# Altium schematic sheet RSD_M1_MOTORCYCLE_UNIT_V2.SchDoc
size A3
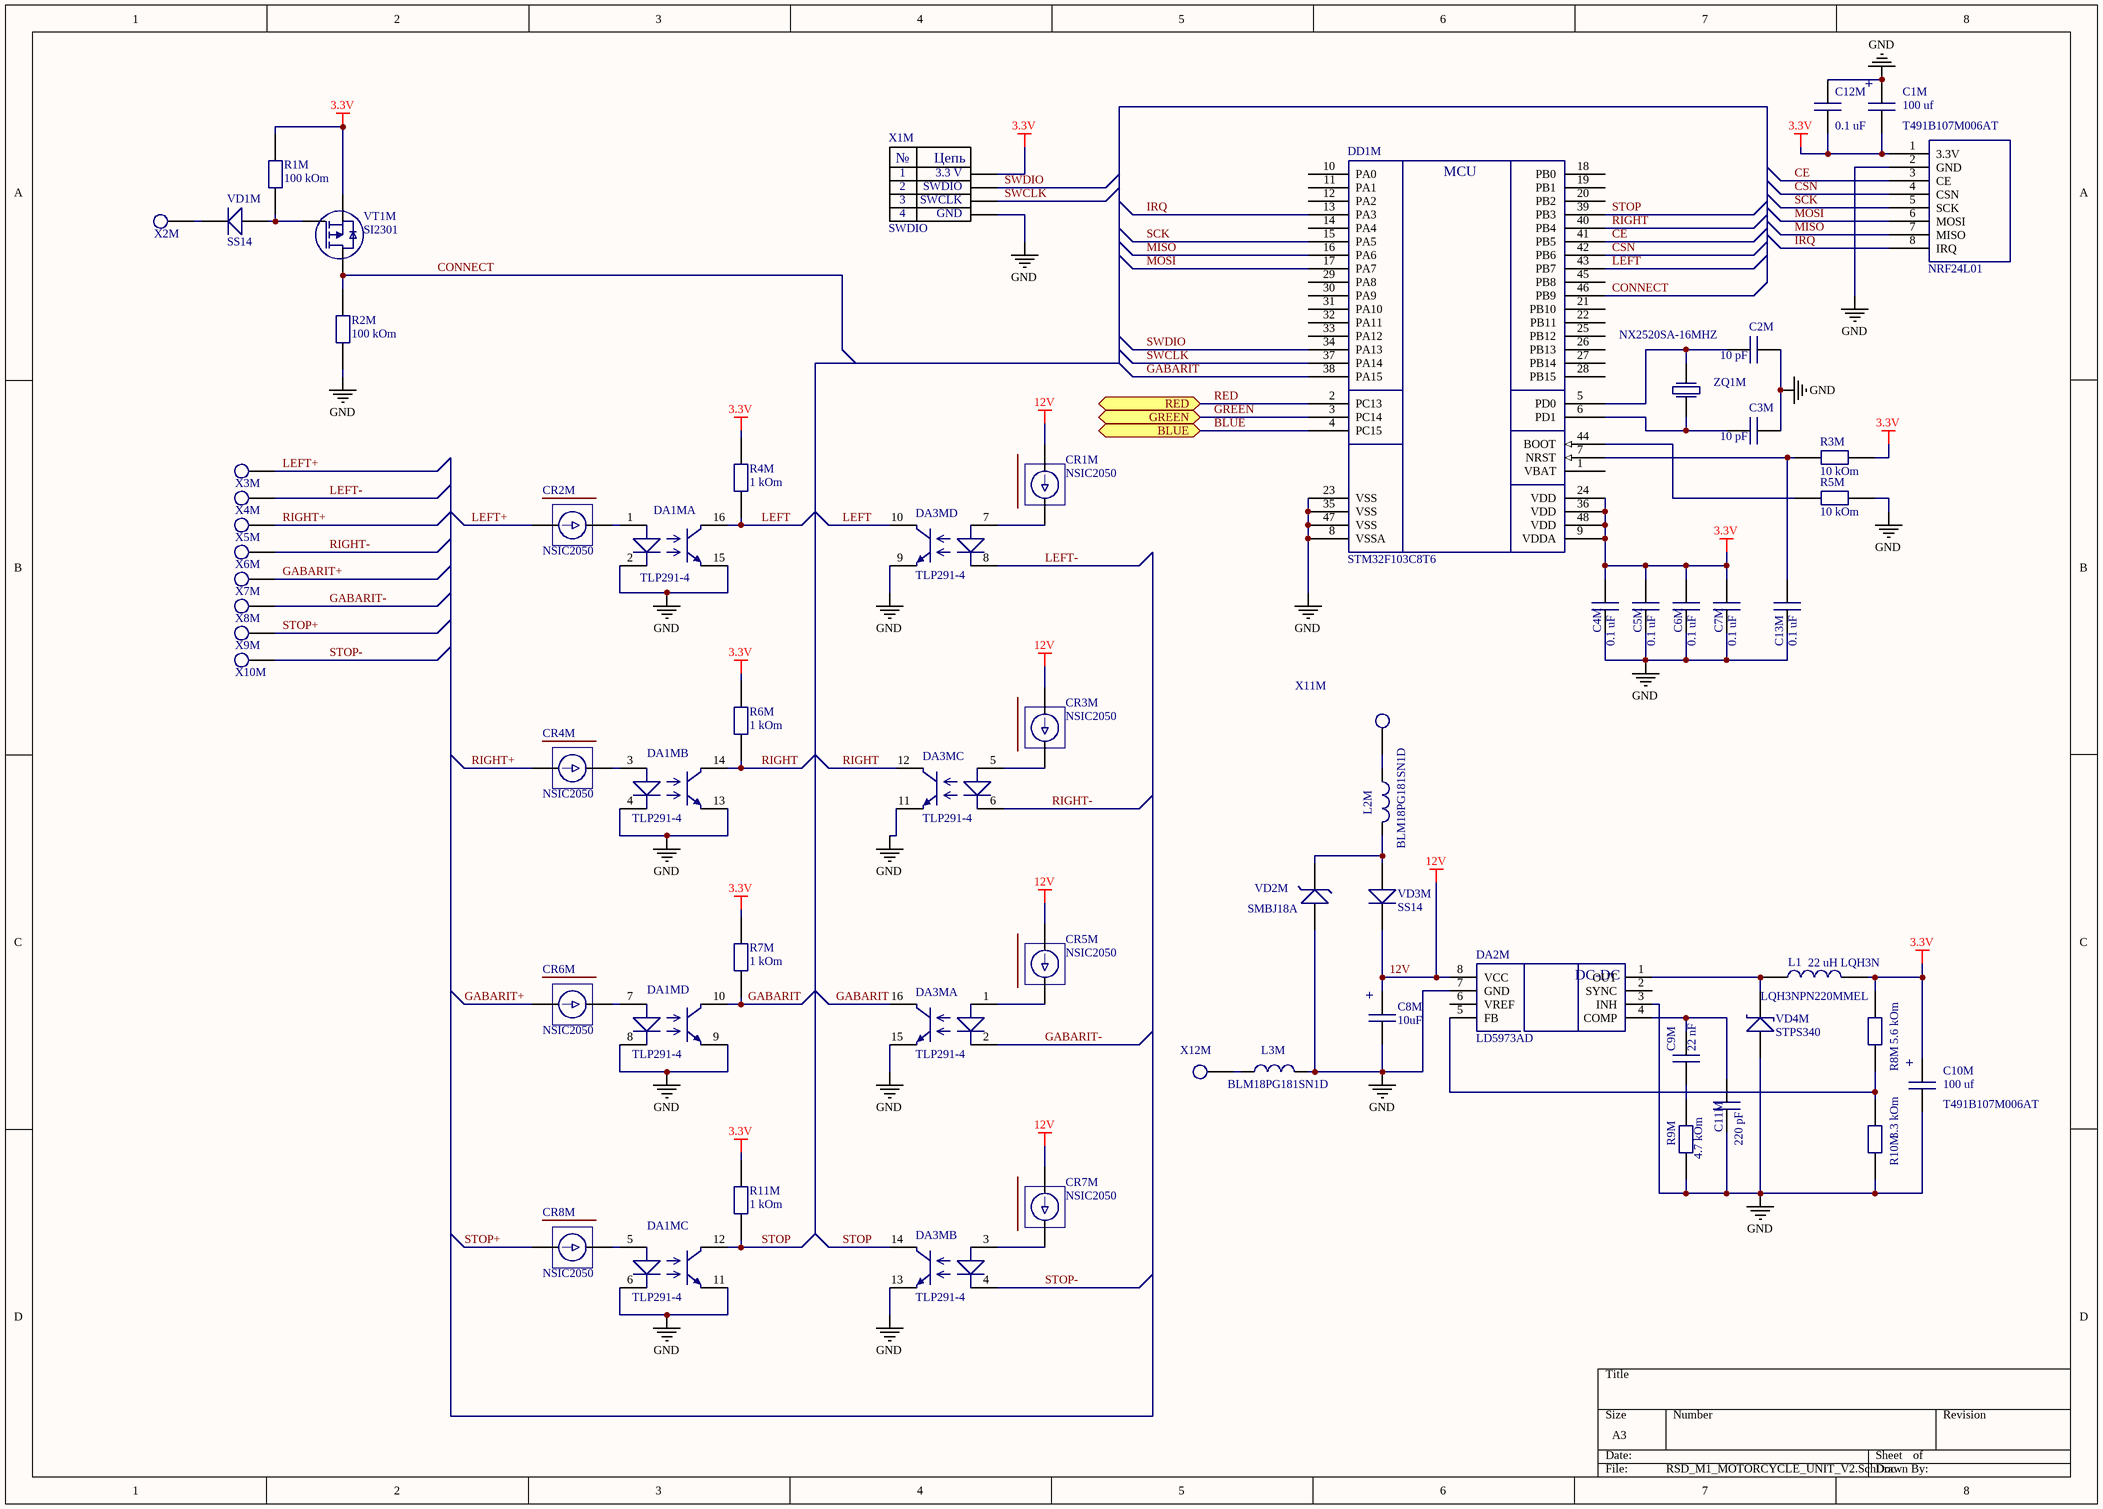
[diagram p0: RSD_M1_MOTORCYCLE_UNIT_V2.SchDoc]

## Parts
C1M  100 uf  value T491B107M006AT  [tantal_case_B]
C2M  value 10 pF  [CAP0603]  (hidden comment: Capacitor)
C3M  value 10 pF  [CAP0603]  (hidden comment: Capacitor)
C4M  value 0.1 uF  [CAP0603]  (hidden comment: Capacitor)
C5M  value 0.1 uF  [CAP0603]  (hidden comment: Capacitor)
C6M  value 0.1 uF  [CAP0603]  (hidden comment: Capacitor)
C7M  value 0.1 uF  [CAP0603]  (hidden comment: Capacitor)
C8M  value 10uF  [tantal_case_A]  (hidden comment: Capacitor_Polar)
C9M  value 22 nF  [CAP0603]  (hidden comment: Capacitor)
C10M  100 uf  value T491B107M006AT  [tantal_case_B]
C11M  value 220 pF  [CAP0603]  (hidden comment: Capacitor)
C12M  value 0.1 uF  [CAP0603]  (hidden comment: Capacitor)
C13M  value 0.1 uF  [CAP0603]  (hidden comment: Capacitor)
CR1M  value NSIC2050  [SMB1]  (hidden comment: NSIC20XX)
CR2M  value NSIC2050  [SMB1]  (hidden comment: NSIC20XX)
CR3M  value NSIC2050  [SMB1]  (hidden comment: NSIC20XX)
CR4M  value NSIC2050  [SMB1]  (hidden comment: NSIC20XX)
CR5M  value NSIC2050  [SMB1]  (hidden comment: NSIC20XX)
CR6M  value NSIC2050  [SMB1]  (hidden comment: NSIC20XX)
CR7M  value NSIC2050  [SMB1]  (hidden comment: NSIC20XX)
CR8M  value NSIC2050  [SMB1]  (hidden comment: NSIC20XX)
DA1M  TLP291-4  [SOP16]  (parts A,B,C,D of 4)
DA2M  LD5973AD  [SOIC-8]
DA3M  TLP291-4  [SOP16]  (parts A,B,C,D of 4)
DD1M  value STM32F103C8T6  [STM32F103C8T6]  (hidden comment: STM32F103C8Tx)
L1  value 22 uH LQH3N  PN: LQH3NPN220MMEL  [LQH3N]  (hidden comment: coil)
L2M  value BLM18PG181SN1D  [IND0603]  (hidden comment: coil)
L3M  value BLM18PG181SN1D  [IND0603]  (hidden comment: coil)
NRF1M  NRF24L01  [NRF24L01]
R1M  value 100 kOm  [Res0603]  (hidden comment: Resistor)
R2M  value 100 kOm  [Res0603]  (hidden comment: Resistor)
R3M  value 10 kOm  [Res0603]  (hidden comment: Resistor)
R4M  value 1 kOm  [Res0603]  (hidden comment: Resistor)
R5M  value 10 kOm  [Res0603]  (hidden comment: Resistor)
R6M  value 1 kOm  [Res0603]  (hidden comment: Resistor)
R7M  value 1 kOm  [Res0603]  (hidden comment: Resistor)
R8M  value 5.6 kOm  [Res0603]  (hidden comment: Resistor)
R9M  value 4.7 kOm  [Res0603]  (hidden comment: Resistor)
R10M  value 3.3 kOm  [Res0603]  (hidden comment: Resistor)
R11M  value 1 kOm  [Res0603]  (hidden comment: Resistor)
VD1M  value SS14  [SMA-F]  (hidden comment: Diode)
VD2M  value SMBJ18A  [SMB1]  (hidden comment: Suppressor)
VD3M  value SS14  [SMA-F]  (hidden comment: Diode)
VD4M  value STPS340  [SMB1]  (hidden comment: Schottky)
VT1M  value SI2301  [SOT 23]  (hidden comment: MOSFET-P)
X1M  SWDIO  1: 3.3 V  3: SWCLK  4: GND  [SWDIO]
X2M  WIRE_CONNECT  [WIRE_CONNECT]  (value not drawn)
X3M  WIRE_CONNECT  [WIRE_CONNECT]  (value not drawn)
X4M  WIRE_CONNECT  [WIRE_CONNECT]  (value not drawn)
X5M  WIRE_CONNECT  [WIRE_CONNECT]  (value not drawn)
X6M  WIRE_CONNECT  [WIRE_CONNECT]  (value not drawn)
X7M  WIRE_CONNECT  [WIRE_CONNECT]  (value not drawn)
X8M  WIRE_CONNECT  [WIRE_CONNECT]  (value not drawn)
X9M  WIRE_CONNECT  [WIRE_CONNECT]  (value not drawn)
X10M  WIRE_CONNECT  [WIRE_CONNECT]  (value not drawn)
X11M  WIRE_CONNECT  [WIRE_CONNECT]  (value not drawn)
X12M  WIRE_CONNECT  [WIRE_CONNECT]  (value not drawn)
ZQ1M  value NX2520SA-16MHZ  [crystal]  (hidden comment: Qartz)

## Ports
BLUE, GREEN, RED

## Nets
3.3V: C1M.2 C4M.2 C5M.2 C6M.2 C7M.2 C10M.1 C12M.1 DD1M.9(VDDA) DD1M.24(VDD) DD1M.36(VDD) DD1M.48(VDD) L1.2 NRF1M.1(3.3V) R1M.1 R3M.2 R4M.2 R6M.2 R7M.2 R8M.1 R11M.2 VT1M.S X1M.1
12V: C8M.1 CR1M.A CR3M.A CR5M.A CR7M.A DA2M.8(VCC) VD3M.1
GND: C1M.1 C2M.1 C3M.1 C4M.1 C5M.1 C6M.1 C7M.1 C8M.2 C10M.2 C11M.1 C12M.2 C13M.1 DA1M.2 DA1M.4 DA1M.6 DA1M.8 DA1M.9 DA1M.11 DA1M.13 DA1M.15 DA2M.3(INH) DA2M.7(GND) DA3M.9 DA3M.11 DA3M.13 DA3M.15 DD1M.8(VSSA) DD1M.23(VSS) DD1M.35(VSS) DD1M.47(VSS) L3M.2 NRF1M.2(GND) R2M.2 R5M.2 R9M.2 R10M.2 VD2M.2 VD4M.2 X1M.4
BLUE: DD1M.4(PC15) ; port BLUE
CE: DD1M.41(PB5) NRF1M.3(CE)
CONNECT: DD1M.46(PB9) R2M.1 VT1M.D
CSN: DD1M.42(PB6) NRF1M.4(CSN)
GABARIT: DA1M.10 DA3M.16 DD1M.38(PA15) R7M.1
GABARIT+: CR6M.A X7M.1
GABARIT-: DA3M.2 X8M.1
GREEN: DD1M.3(PC14) ; port GREEN
IRQ: DD1M.13(PA3) NRF1M.8(IRQ)
LEFT: DA1M.16 DA3M.10 DD1M.43(PB7) R4M.1
LEFT+: CR2M.A X3M.1
LEFT-: DA3M.8 X4M.1
MISO: DD1M.16(PA6) NRF1M.7(MISO)
MOSI: DD1M.17(PA7) NRF1M.6(MOSI)
RED: DD1M.2(PC13) ; port RED
RIGHT: DA1M.14 DA3M.12 DD1M.40(PB4) R6M.1
RIGHT+: CR4M.A X5M.1
RIGHT-: DA3M.6 X6M.1
SCK: DD1M.15(PA5) NRF1M.5(SCK)
STOP: DA1M.12 DA3M.14 DD1M.39(PB3) R11M.1
STOP+: CR8M.A X9M.1
STOP-: DA3M.4 X10M.1
SWCLK: DD1M.37(PA14) X1M.3
SWDIO: DD1M.34(PA13) X1M.2
NetC2M_2: C2M.2 DD1M.5(PD0) ZQ1M.2
NetC3M_2: C3M.2 DD1M.6(PD1) ZQ1M.1
NetC9M_1: C9M.1 R9M.1
NetC9M_2: C9M.2 C11M.2 DA2M.4(COMP)
NetC13M_2: C13M.2 DD1M.7(NRST) R3M.1
NetCR1M_K: CR1M.K DA3M.7
NetCR2M_K: CR2M.K DA1M.1
NetCR3M_K: CR3M.K DA3M.5
NetCR4M_K: CR4M.K DA1M.3
NetCR5M_K: CR5M.K DA3M.1
NetCR6M_K: CR6M.K DA1M.7
NetCR7M_K: CR7M.K DA3M.3
NetCR8M_K: CR8M.K DA1M.5
NetDA2M_1: DA2M.1(OUT) L1.1 VD4M.1
NetDA2M_5: DA2M.5(FB) R8M.2 R10M.1
NetDD1M_44: DD1M.44(BOOT) R5M.1
NetL2M_1: L2M.1 X11M.1
NetL2M_2: L2M.2 VD2M.1 VD3M.2
NetL3M_1: L3M.1 X12M.1
NetR1M_2: R1M.2 VD1M.2 VT1M.G
NetVD1M_1: VD1M.1 X2M.1

Not connected (* = marked no-connect by the designer): DA2M 2(SYNC) 6(VREF); DD1M 1(VBAT) 10(PA0) 11(PA1) 12(PA2) 14(PA4) 18(PB0) 19(PB1) 20(PB2) 21(PB10) 22(PB11) 25(PB12) 26(PB13) 27(PB14) 28(PB15) 29(PA8) 30(PA9) 31(PA10) 32(PA11) 33(PA12) 45(PB8)

## Notes on the sheet
- (in symbol Capacitor_Polar) +
- (in symbol LD5973AD) DC-DC
- (in symbol STM32F103C8Tx) MCU
- (in symbol SWDIO) №; Цепь

## Library data of the parts
C1M C10M = Capacitor_Polar
CR1M CR2M CR3M CR4M CR5M CR6M CR7M CR8M = NSIC20XX: pin to pad: A>2 K>1
VT1M = MOSFET-P: pin to pad: D>3 G>1 S>2
DA1M DA3M = TLP291-4: Value: TLP291-4
DA2M = LD5973AD: Value: LD5973AD
X1M = SWDIO: 2: SWDIO